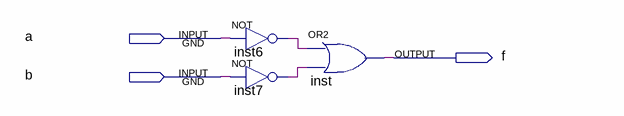
[diagram p0: schematic sheet]
// Quartus schematic 1-4-after.bdf as structural Verilog: 3 symbols, 3 pins
module \1-4-after  (
  input  a,
  input  b,
  output f
);

  wire inst6_out, inst7_out;

  not inst6 (inst6_out, a);
  not inst7 (inst7_out, b);
  or inst (f, inst6_out, inst7_out);
endmodule
